# EAGLE design h2oiq_v4_long (EAGLE 6.3)
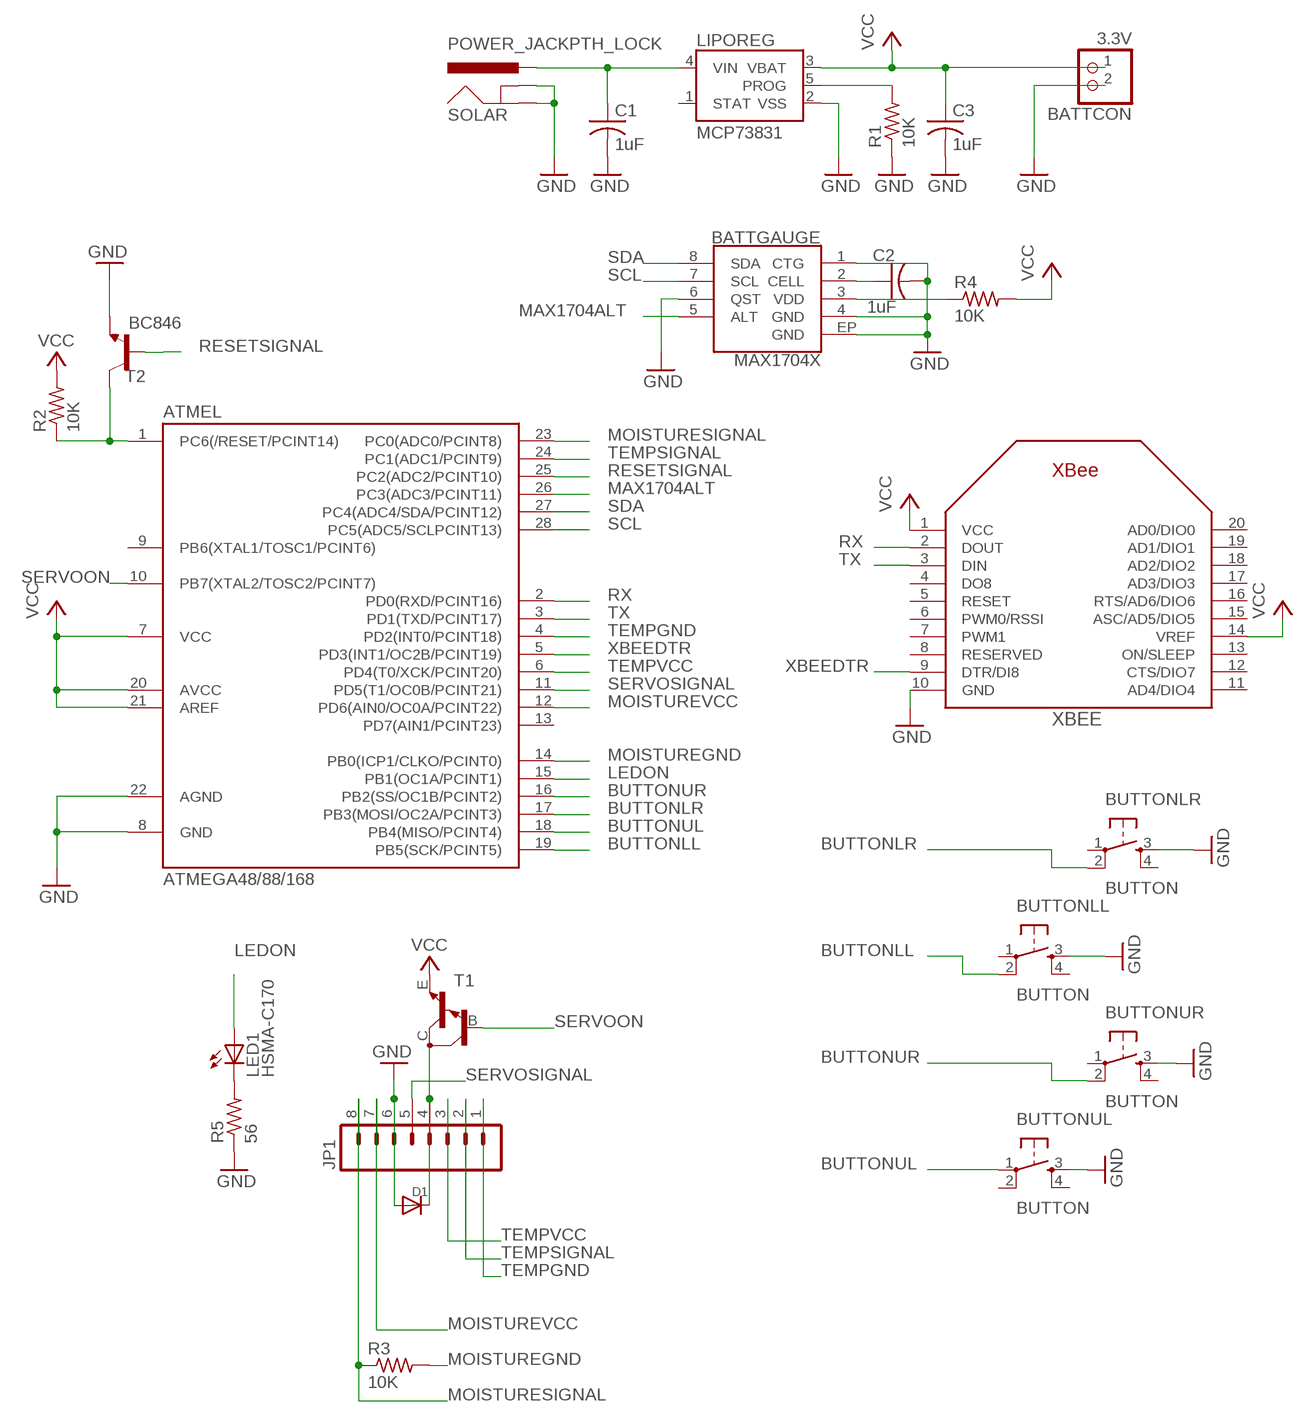
[diagram p0: schematic, sheet 1]

## Parts
ATMEL  ATMEGA48/88/168  MEGA48/88/168-PU  [DIL28-3]
BATTCON  3.3V  JST_2PIN-THM  [JST-PH-2-THM]
BATTGAUGE  MAX1704X  [TDFN-8]
BUTTONLL  BUTTON  TAC_SWITCHPTH  [TACTILE-PTH]
BUTTONLR  BUTTON  TAC_SWITCHPTH  [TACTILE-PTH]
BUTTONUL  BUTTON  TAC_SWITCHPTH  [TACTILE-PTH]
BUTTONUR  BUTTON  TAC_SWITCHPTH  [TACTILE-PTH]
C1  1uF  C-USC0603K  [C0603K]
C2  1uF  C-USC0603K  [C0603K]
C3  1uF  C-USC0603K  [C0603K]
D1  DIODESMA  [SMADIODE]
JP1  M081X08  [1X08]
LED1  HSMA-C170  LED  [SMARTLED-TTW]
LIPOREG  MCP73831  [SOT23-5]
R1  10K  R-US_R0805  [R0805]
R2  10K  R-US_R0805  [R0805]
R3  10K  R-US_R0805  [R0805]
R4  10K  R-US_R0805  [R0805]
R5  56  R-US_R0805  [R0805]
SOLAR  POWER_JACKPTH_LOCK  [POWER_JACK_PTH_LOCK]
T1  MMBTA13LT1-NPN_DARL-SOT23-BEC  [SOT23-BEC]
T2  BC846  [SOT23]
XBEE  XBEE  [XBEE]

## Nets
BUTTONLL: ATMEL.19(PB5(SCK/PCINT5)) BUTTONLL.2
BUTTONLR: ATMEL.17(PB3(MOSI/OC2A/PCINT3)) BUTTONLR.2
BUTTONUL: ATMEL.18(PB4(MISO/PCINT4)) BUTTONUL.1
BUTTONUR: ATMEL.16(PB2(SS/OC1B/PCINT2)) BUTTONUR.2
GND: ATMEL.8(GND) ATMEL.22(AGND) BATTCON.2 BATTGAUGE.1(CTG) BATTGAUGE.4(GND) BATTGAUGE.6(QST) BATTGAUGE.EP(GND) BUTTONLL.3 BUTTONLR.3 BUTTONUL.3 BUTTONUR.3 C1.2 C2.2 C3.2 D1.A JP1.6 LIPOREG.2(VSS) R1.1 R5.1 SOLAR.GND SOLAR.GNDBREAK T2.2(E) XBEE.10(GND)
LEDON: ATMEL.15(PB1(OC1A/PCINT1)) LED1.A@1(A)
MAX1704ALT: ATMEL.26(PC3(ADC3/PCINT11)) BATTGAUGE.5(ALT)
MOISTUREGND: ATMEL.14(PB0(ICP1/CLKO/PCINT0)) R3.2
MOISTURESIGNAL: ATMEL.23(PC0(ADC0/PCINT8)) JP1.8 R3.1
MOISTUREVCC: ATMEL.12(PD6(AIN0/OC0A/PCINT22)) JP1.7
N$1: BATTGAUGE.3(VDD) R4.1
N$2: LIPOREG.5(PROG) R1.2
N$3: ATMEL.1(PC6(/RESET/PCINT14)) R2.1 T2.3(C)
N$11: LED1.C@1(C) R5.2
N$23: BATTGAUGE.2(CELL) C2.1
RESETSIGNAL: ATMEL.25(PC2(ADC2/PCINT10)) T2.1(B)
RX: ATMEL.2(PD0(RXD/PCINT16)) XBEE.2(DOUT)
SCL: ATMEL.28(PC5(ADC5/SCLPCINT13)) BATTGAUGE.7(SCL)
SDA: ATMEL.27(PC4(ADC4/SDA/PCINT12)) BATTGAUGE.8(SDA)
SERVOACT: D1.C JP1.4 T1.C
SERVOON: ATMEL.10(PB7(XTAL2/TOSC2/PCINT7)) T1.B
SERVOSIGNAL: ATMEL.11(PD5(T1/OC0B/PCINT21)) JP1.5
TEMPGND: ATMEL.4(PD2(INT0/PCINT18)) JP1.1
TEMPSIGNAL: ATMEL.24(PC1(ADC1/PCINT9)) JP1.2
TEMPVCC: ATMEL.6(PD4(T0/XCK/PCINT20)) JP1.3
TX: ATMEL.3(PD1(TXD/PCINT17)) XBEE.3(DIN)
VCC: ATMEL.7(VCC) ATMEL.20(AVCC) ATMEL.21(AREF) BATTCON.1 C3.1 LIPOREG.3(VBAT) R2.2 R4.2 T1.E XBEE.1(VCC) XBEE.14(VREF)
VIN: C1.1 LIPOREG.4(VIN) SOLAR.PWR
XBEEDTR: ATMEL.5(PD3(INT1/OC2B/PCINT19)) XBEE.9(DTR/DI8)
Unconnected: ATMEL.9(PB6(XTAL1/TOSC1/PCINT6)) ATMEL.13(PD7(AIN1/PCINT23)) BUTTONLL.1 BUTTONLL.4 BUTTONLR.1 BUTTONLR.4 BUTTONUL.2 BUTTONUL.4 BUTTONUR.1 BUTTONUR.4 LIPOREG.1(STAT) XBEE.4(DO8) XBEE.5(RESET) XBEE.6(PWM0/RSSI) XBEE.7(PWM1) XBEE.8(RESERVED) XBEE.11(AD4/DIO4) XBEE.12(CTS/DIO7) XBEE.13(ON/SLEEP) XBEE.15(ASC/AD5/DIO5) XBEE.16(RTS/AD6/DIO6) XBEE.17(AD3/DIO3) XBEE.18(AD2/DIO2) XBEE.19(AD1/DIO1) XBEE.20(AD0/DIO0)

## Library data of the parts
ATMEL = avr-4:MEGA48/88/168-PU
BATTCON = adafruit:JST_2PIN: JST 2-Pin Connectors of various flavors SMT-RA (S2B-PH-SM4) 4UConnector #17311 SMT (B2B-PH-SM4) THM-RA (S2B-PH) THM (B2B-PH)
BATTGAUGE = SparkFun:MAX1704X: MAX17043/MAX17044: Battery Fuel Guage (43 is 1cell, 44 is 2cell)
BUTTONLL BUTTONLR BUTTONUL BUTTONUR = SparkFun:TAC_SWITCH: Momentary Switch Button commonly used for reset or general input. Spark Fun Electronics SKU : COM-00097
C1-C3 = rcl:C-US: CAPACITOR, American symbol
D1 = adafruit:DIODE: Diode SMADIODE - SMA Surface Mount Package 20V 1A Schottky Diode Digikey: 641-1014-6-ND DO-1N4148 - Through Hole Small Current Diode SOD-123 20V 1 A (.5mV Vf) Schottky Diode - Digikey: MBRX120TPMSCT-ND SOD-323 10V 570mA (.38mV Vf, 3ns) Schottky Diode - Digikey: ZLLS410CT-ND SOD-523 30V 30mA Schottky Diode (RB751S-40TE61) - Digikey: RB751S-40TE61CT-ND SOT23-R/W - SOT23 Package (R = Solder Paste/Reflow Ovens, W = Hand-Soldering) BAT54Film 40V 300mA - Digikey: 497-7162-1-ND
JP1 = SparkFun:M08: Header 8 Standard 8-pin 0.1" header. Use with straight break away headers (SKU : PRT-00116), right angle break away headers (PRT-00553), swiss pins (PRT-00743), machine pins (PRT-00117), and female headers (PRT-00115).
LED1 = led:LED: LED OSRAM: - CHIPLED LG R971, LG N971, LY N971, LG Q971, LY Q971, LO R971, LY R971 LH N974, LH R974 LS Q976, LO Q976, LY Q976 LO Q996 - Hyper CHIPLED LW Q18S LB Q993, LB Q99A, LB R99A - SideLED LS A670, LO A670, LY A670, LG A670, LP A670 LB A673, LV A673, LT A673, LW A673 LH A674 LY A675 LS A676, LA A676, LO A676, LY A676, LW A676 LS A679, LY A679, LG A679 - Hyper Micro SIDELED® LS Y876, LA Y876, LO Y876, LY Y876 LT Y87S - SmartLED LW L88C, LW L88S LB L89C, LB L89S, LG L890 LS L89K, LO L89K, LY L89K LS L896, LA L896, LO L896, LY L896 - TOPLED LS T670, LO T670, LY T670, LG T670, LP T670 LSG T670, LSP T670, LSY T670, LOP T670, LYG T670 LG T671, LOG T671, LSG T671 LB T673, LV T673, LT T673, LW T673 LH T674 LS T676, LA T676, LO T676, LY T676, LB T676, LH T676, LSB T676, LW T676 LB T67C, LV T67C, LT T67C, LS T67K, LO T67K, LY T67K, LW E67C LS E67B, LA E67B, LO E67B, LY E67B, LB E67C, LV E67C, LT E67C LW T67C LS T679, LY T679, LG T679 LS T770, LO T770, LY T770, LG T770, LP T770 LB T773, LV T773, LT T773, LW T773 LH T774 LS E675, LA E675, LY E675, LS T675 LS T776, LA T776, LO T776, LY T776, LB T776 LHGB T686 LT T68C, LB T68C - Hyper Mini TOPLED® LB M676 - Mini TOPLED Santana® LG M470 LS M47K, LO M47K, LY M47K Source: http://www.osram.convergy.de LUXEON: - LUMILED® LXK2-PW12-R00, LXK2-PW12-S00, LXK2-PW14-U00, LXK2-PW14-V00 LXK2-PM12-R00, LXK2-PM12-S00, LXK2-PM14-U00 LXK2-PE12-Q00, LXK2-PE12-R00, LXK2-PE12-S00, LXK2-PE14-T00, LXK2-PE14-U00 LXK2-PB12-K00, LXK2-PB12-L00, LXK2-PB12-M00, LXK2-PB14-N00, LXK2-PB14-P00, LXK2-PB14-Q00 LXK2-PR12-L00, LXK2-PR12-M00, LXK2-PR14-Q00, LXK2-PR14-R00 LXK2-PD12-Q00, LXK2-PD12-R00, LXK2-PD12-S00 LXK2-PH12-R00, LXK2-PH12-S00 LXK2-PL12-P00, LXK2-PL12-Q00, LXK2-PL12-R00 Source: www.luxeon.com KINGBRIGHT: KA-3528ASYC Source: www.kingbright.com
LIPOREG = SparkFun:MCP73831: Microchip's MCP73831 Miniature single cell, fully integrated Li-Ion, Li-polymer charge management controller http://ww1.microchip.com/downloads/en/DeviceDoc/21984a.pdf
R1-R5 = resistor:R-US_: RESISTOR, American symbol
SOLAR = SparkFun:POWER_JACK: Power Jack This is the standard 5.5mm barrel jack for power. The PTH is the most common, proven, reliable, footprint. All others are experimental. The Slot footprint only works if the mill layer is transmitted to the PCB fab house so be warned. Spark Fun Electronics SKU : PRT-00119. Mating wall wart : TOL-00298 (and others)
T1 = transistor:*-NPN_DARL-: NPN Darlington Transistor
T2 = transistor:BC846: NPN TRANSISTOR
XBEE = adafruit:XBEE

## Board
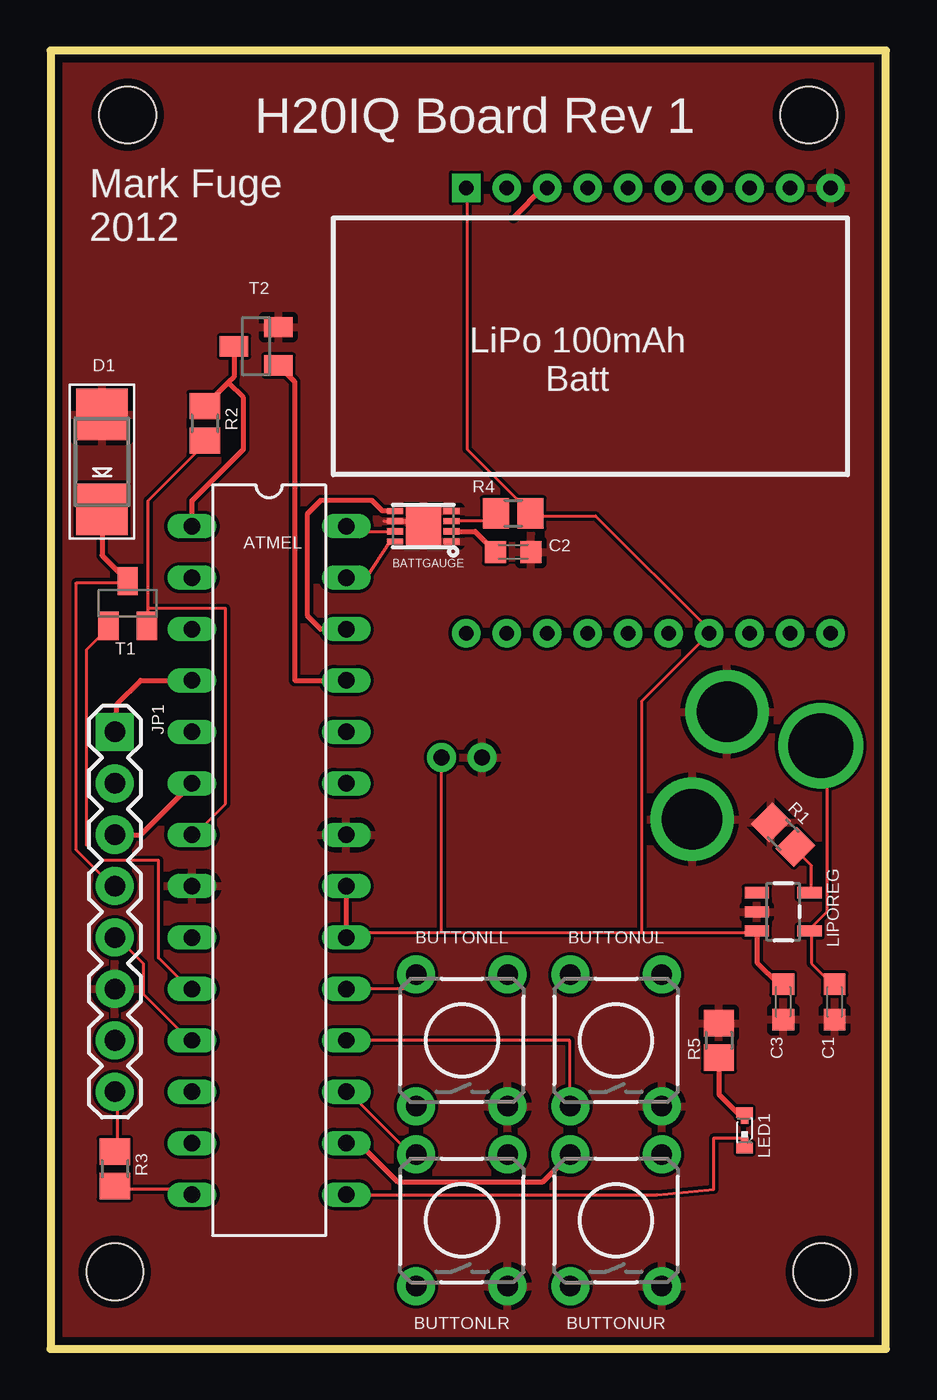
[diagram p1: board, top side]
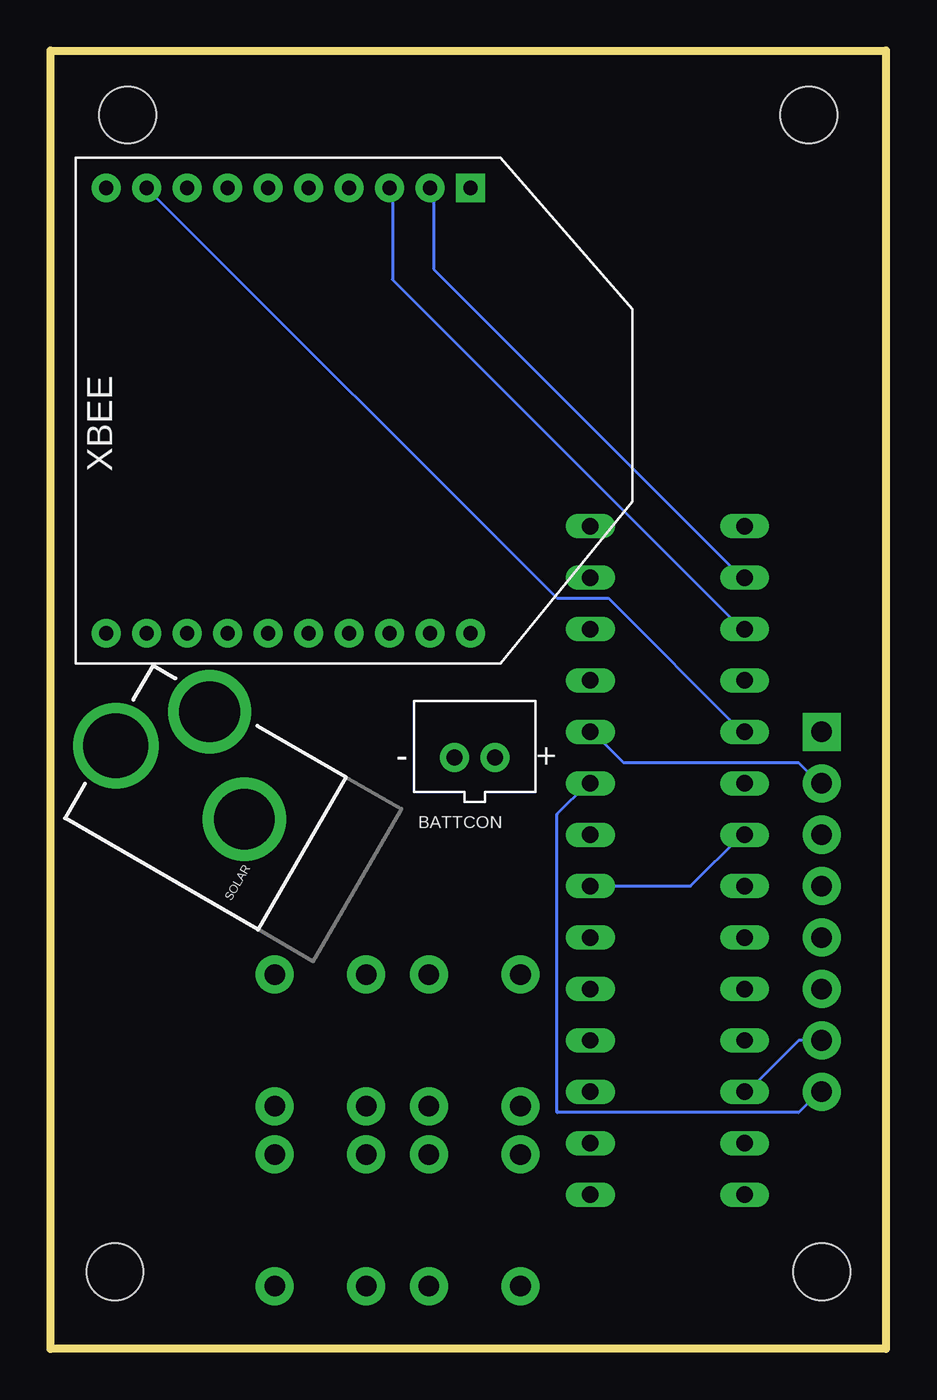
[diagram p2: board, bottom side, seen from below]

Size 41.27 x 64.14 mm. Coordinates in mm from the lower left corner, seen from the top.
Outline: 0,0 41.27,0 41.27,64.14 0,64.14 0,0
Copper layers (1*16): Top 0.0356mm / dielectric 1.5011mm / Bottom 0.0356mm
Design rules "LaenPCBOrder": minimum track width 6mil, minimum drill 13mil, track to track 6mil, track to pad 6mil, pad to pad 6mil, via to via 6mil, smd to smd 6mil, copper to edge 15mil, drill to drill 6mil, minimum pad ring 7mil, minimum via ring 7mil, stop-mask expansion 4mil, vias tented up to drill 0mil, thermal gap 10mil
Holes 2.8 mm at 3.81,60.96 37.47,60.96 3.17,3.81 38.1,3.81

### Footprints (pad centres in the part's own frame; a part is rotated, then mirrored left to right if it is on the bottom)
DIL28-3 = drill 0.813 long: 1 -16.51,-3.81; 2 -13.97,-3.81; 3 -11.43,-3.81; 4 -8.89,-3.81; 5 -6.35,-3.81; 6 -3.81,-3.81; 7 -1.27,-3.81; 8 1.27,-3.81; 9 3.81,-3.81; 10 6.35,-3.81; 11 8.89,-3.81; 12 11.43,-3.81; 13 13.97,-3.81; 14 16.51,-3.81; 15 16.51,3.81; 16 13.97,3.81; 17 11.43,3.81; 18 8.89,3.81; 19 6.35,3.81; 20 3.81,3.81; 21 1.27,3.81; 22 -1.27,3.81; 23 -3.81,3.81; 24 -6.35,3.81; 25 -8.89,3.81; 26 -11.43,3.81; 27 -13.97,3.81; 28 -16.51,3.81
JST-PH-2-THM = drill 0.8 pad 1.422: 1 1,0; 2 -1,0
TDFN-8 = smd 0.8 x 0.3: 1 -1.4,0.75; 2 -1.4,0.25; 3 -1.4,-0.25; 4 -1.4,-0.75; 5 1.4,-0.75; 6 1.4,-0.25; 7 1.4,0.25; 8 1.4,0.75 | smd 1.73 x 1.88: EP 0,0
TACTILE-PTH = drill 1.016 pad 1.88: 1 -3.251,2.261; 2 3.251,2.261; 3 -3.251,-2.261; 4 3.251,-2.261
C0603K = smd 1.05 x 1.08: 1 -0.875,0; 2 0.875,0
SMADIODE = smd 2.54 x 2.54: A 2.349,0; C -2.349,0
1X08 = drill 1.016 pad 1.88 square: 1 0,0 | drill 1.016 pad 1.88: 2 2.54,0; 3 5.08,0; 4 7.62,0; 5 10.16,0; 6 12.7,0; 7 15.24,0; 8 17.78,0
SMARTLED-TTW = smd 0.8 x 0.5: A 0,-0.875; C 0,0.875 | smd 0.35 x 0.35: A@1 0,-0.5; C@1 0,0.5
SOT23-5 = smd 0.55 x 1.2: 1 -0.95,-1.3; 2 0,-1.3; 3 0.95,-1.3; 4 0.95,1.3; 5 -0.95,1.3
R0805 = smd 1.3 x 1.5: 1 -0.85,0; 2 0.85,0
POWER_JACK_PTH_LOCK = drill 2.997 pad 4.115: GND 0.025,6.557; GNDBREAK 3.762,10.7 | drill 3.2 pad 4.115: PWR 0,13.878
SOT23-BEC = smd 1 x 1.4: B -0.95,-1.1; C 0,1.1; E 0.95,-1.1
SOT23 = smd 1 x 1.4: 1 -0.95,-1.1; 2 0.95,-1.1; 3 0,1.1
XBEE = drill 0.7 pad 1.422 square: 1 -11,5.5 | drill 0.7 pad 1.422: 2 -11,3.5; 3 -11,1.5; 4 -11,-0.5; 5 -11,-2.5; 6 -11,-4.5; 7 -11,-6.5; 8 -11,-8.5; 9 -11,-10.5; 10 -11,-12.5; 11 11,-12.5; 12 11,-10.5; 13 11,-8.5; 14 11,-6.5; 15 11,-4.5; 16 11,-2.5; 17 11,-0.5; 18 11,1.5; 19 11,3.5; 20 11,5.5

### Placement (x,y rotation side)
ATMEL  10.79,24.13 270 top
BATTCON  20.32,29.21 0 bottom
BATTGAUGE  18.41,40.64 180 top
BUTTONLL  20.32,15.24 90 top
BUTTONLR  20.32,6.35 90 top
BUTTONUL  27.94,15.24 90 top
BUTTONUR  27.94,6.35 90 top
C1  38.73,17.14 270 top
C2  22.86,39.37 0 top
C3  36.2,17.14 270 top
D1  2.54,43.81 90 top
JP1  3.17,30.48 270 top
LED1  34.29,10.79 0 top
LIPOREG  36.2,21.59 270 top
R1  36.2,25.4 315 top
R2  7.62,45.72 270 top
R3  3.17,8.89 270 top
R4  22.86,41.27 0 top
R5  33.02,15.24 270 top
SOLAR  26.04,22.86 60 bottom
T1  3.81,36.83 0 top
T2  10.16,49.53 90 top
XBEE  26.04,46.35 270 bottom

### Tracks (layer width: path | path; a pad name or v marks a point on that pad's centre or on a via)
BUTTONLL
  Top 0.152: ATMEL.19 18.03,17.78 18.03,18.29 BUTTONLL.2
BUTTONLR
  Top 0.152: ATMEL.17 14.73,12.7 18.03,9.4 BUTTONLR.2
BUTTONUL
  Top 0.152: ATMEL.18 25.65,15.24 25.65,12.19 BUTTONUL.1
BUTTONUR
  Top 0.254: ATMEL.16 15.24,10.16 17.14,8.26 24.33,8.26 BUTTONUR.2
GND
  Top 0.152: BATTGAUGE.6 16.76,40.89 16.51,40.89 16.46,40.89
  Top 0.254: BATTGAUGE.6 18.16,40.89 BATTGAUGE.EP
  pour Top: -1.27,64.77 -1.27,-1.27 41.91,-1.27 41.91,64.77
LEDON
  Top 0.152: ATMEL.15 29.97,7.62 32.77,7.87 32.77,10.41 34.29,10.41 LED1.A@1
MAX1704ALT
  Top 0.254: BATTGAUGE.5 16.39,41.39 15.88,41.91 13.34,41.91 12.7,41.27 12.7,36.2 13.34,35.56 ATMEL.26
MOISTUREGND
  Top 0.152: R3.2 3.3,7.87 6.86,7.87 6.86,7.62 ATMEL.14
MOISTURESIGNAL
  Top 0.152: R3.1 3.3,9.91 3.3,12.7 JP1.8
  Bottom 0.152: JP1.8 3.3,12.7 4.32,11.68 16.26,11.68 16.26,26.42 14.73,27.94 ATMEL.23
MOISTUREVCC
  Bottom 0.152: JP1.7 4.32,15.24 6.86,12.7 ATMEL.12
N$1
  Top 0.152: BATTGAUGE.3 20.07,40.89 21.84,40.89 21.84,41.15 R4.1
N$2
  Top 0.152: R1.2 36.83,24.64 37.59,23.88 37.59,22.61 LIPOREG.5
N$3
  Top 0.254: T2.3 9.06,48.01 8.78,47.73 | 8.78,47.73 R2.1 | ATMEL.1 6.99,41.91 9.53,44.45 9.53,46.99 8.78,47.73
N$11
  Top 0.254: R5.2 33.02,12.56 LED1.C@1
N$23
  Top 0.152: 20.07,40.39 BATTGAUGE.2 | 21.84,39.37 C2.1
  Top 0.254: 20.07,40.39 20.97,40.39 C2.1
RESETSIGNAL
  Top 0.254: ATMEL.25 12.06,33.02 12.06,47.77 T2.1
RX
  Bottom 0.152: ATMEL.2 7.11,38.1 22.35,53.34 22.35,57.15 XBEE.2
SCL
  Top 0.152: ATMEL.28 14.61,40.39 16.76,40.39 BATTGAUGE.7
SDA
  Top 0.152: ATMEL.27 15.62,38.1 16.76,39.88 BATTGAUGE.8
SERVOACT
  Top 0.152: T1.C 3.81,37.85 1.27,37.85 1.27,24.64 3.05,22.86 JP1.4
  Top 0.254: D1.C 2.54,39.2 T1.C
SERVOON
  Top 0.152: T1.B 2.79,35.56 1.78,34.54 1.78,24.89 2.54,24.13 5.33,24.13 5.33,19.3 6.86,17.78 ATMEL.10
SERVOSIGNAL
  Top 0.152: ATMEL.11 6.86,15.24 4.57,17.53 4.57,19.05 3.3,20.32 JP1.5
TEMPGND
  Top 0.254: JP1.1 3.3,31.88 4.45,33.02 ATMEL.4
TEMPSIGNAL
  Bottom 0.152: ATMEL.24 14.48,30.48 12.95,28.96 4.32,28.96 3.3,27.94 JP1.2
TEMPVCC
  Top 0.254: JP1.3 4.45,25.4 ATMEL.6
TX
  Top 0.254: XBEE.3 24.34,57.35 22.86,55.88
  Bottom 0.152: ATMEL.3 7.11,35.56 24.38,52.83 24.38,57.15 XBEE.3
VCC
  Top 0.152: 4.83,36.58 4.83,35.81 T1.E | 4.83,36.58 4.83,41.91 7.62,44.7 R2.2 | 4.83,36.58 8.64,36.58 8.64,26.92 7.11,25.4 ATMEL.7 | XBEE.1 20.57,57.15 20.57,44.45 23.62,41.4 R4.2 23.88,41.15 26.92,41.15 32.51,35.56 XBEE.14 32.51,35.31 29.21,32 29.21,20.57 | 19.3,20.57 14.73,20.57 14.73,20.32 ATMEL.20 | 19.3,20.57 29.21,20.57 | 29.21,20.57 34.8,20.57 LIPOREG.3 | 19.3,20.57 19.3,29.21 BATTCON.1
  Top 0.254: ATMEL.21 ATMEL.20 | C3.1 35.95,18.02 34.92,19.05 34.92,20.61 LIPOREG.3
  Bottom 0.152: ATMEL.21 9.65,22.86 7.11,25.4 ATMEL.7
VIN
  Top 0.152: C1.1 38.61,18.03 37.59,19.05 37.59,20.57 LIPOREG.4 37.59,20.83 38.35,21.59 38.35,28.7 38.1,28.96 SOLAR.PWR
XBEEDTR
  Bottom 0.152: ATMEL.5 7.11,30.48 13.72,37.08 16.26,37.08 36.32,57.15 XBEE.9

### Text on the board
tPlace: H20IQ Board Rev 1 | Mark Fuge / 2012 | LiPo 100mAh / Batt